# Altium schematic sheet EFR32xG22_LC_REF_DES_A02_Cover.SchDoc
size 420 x 297 mm
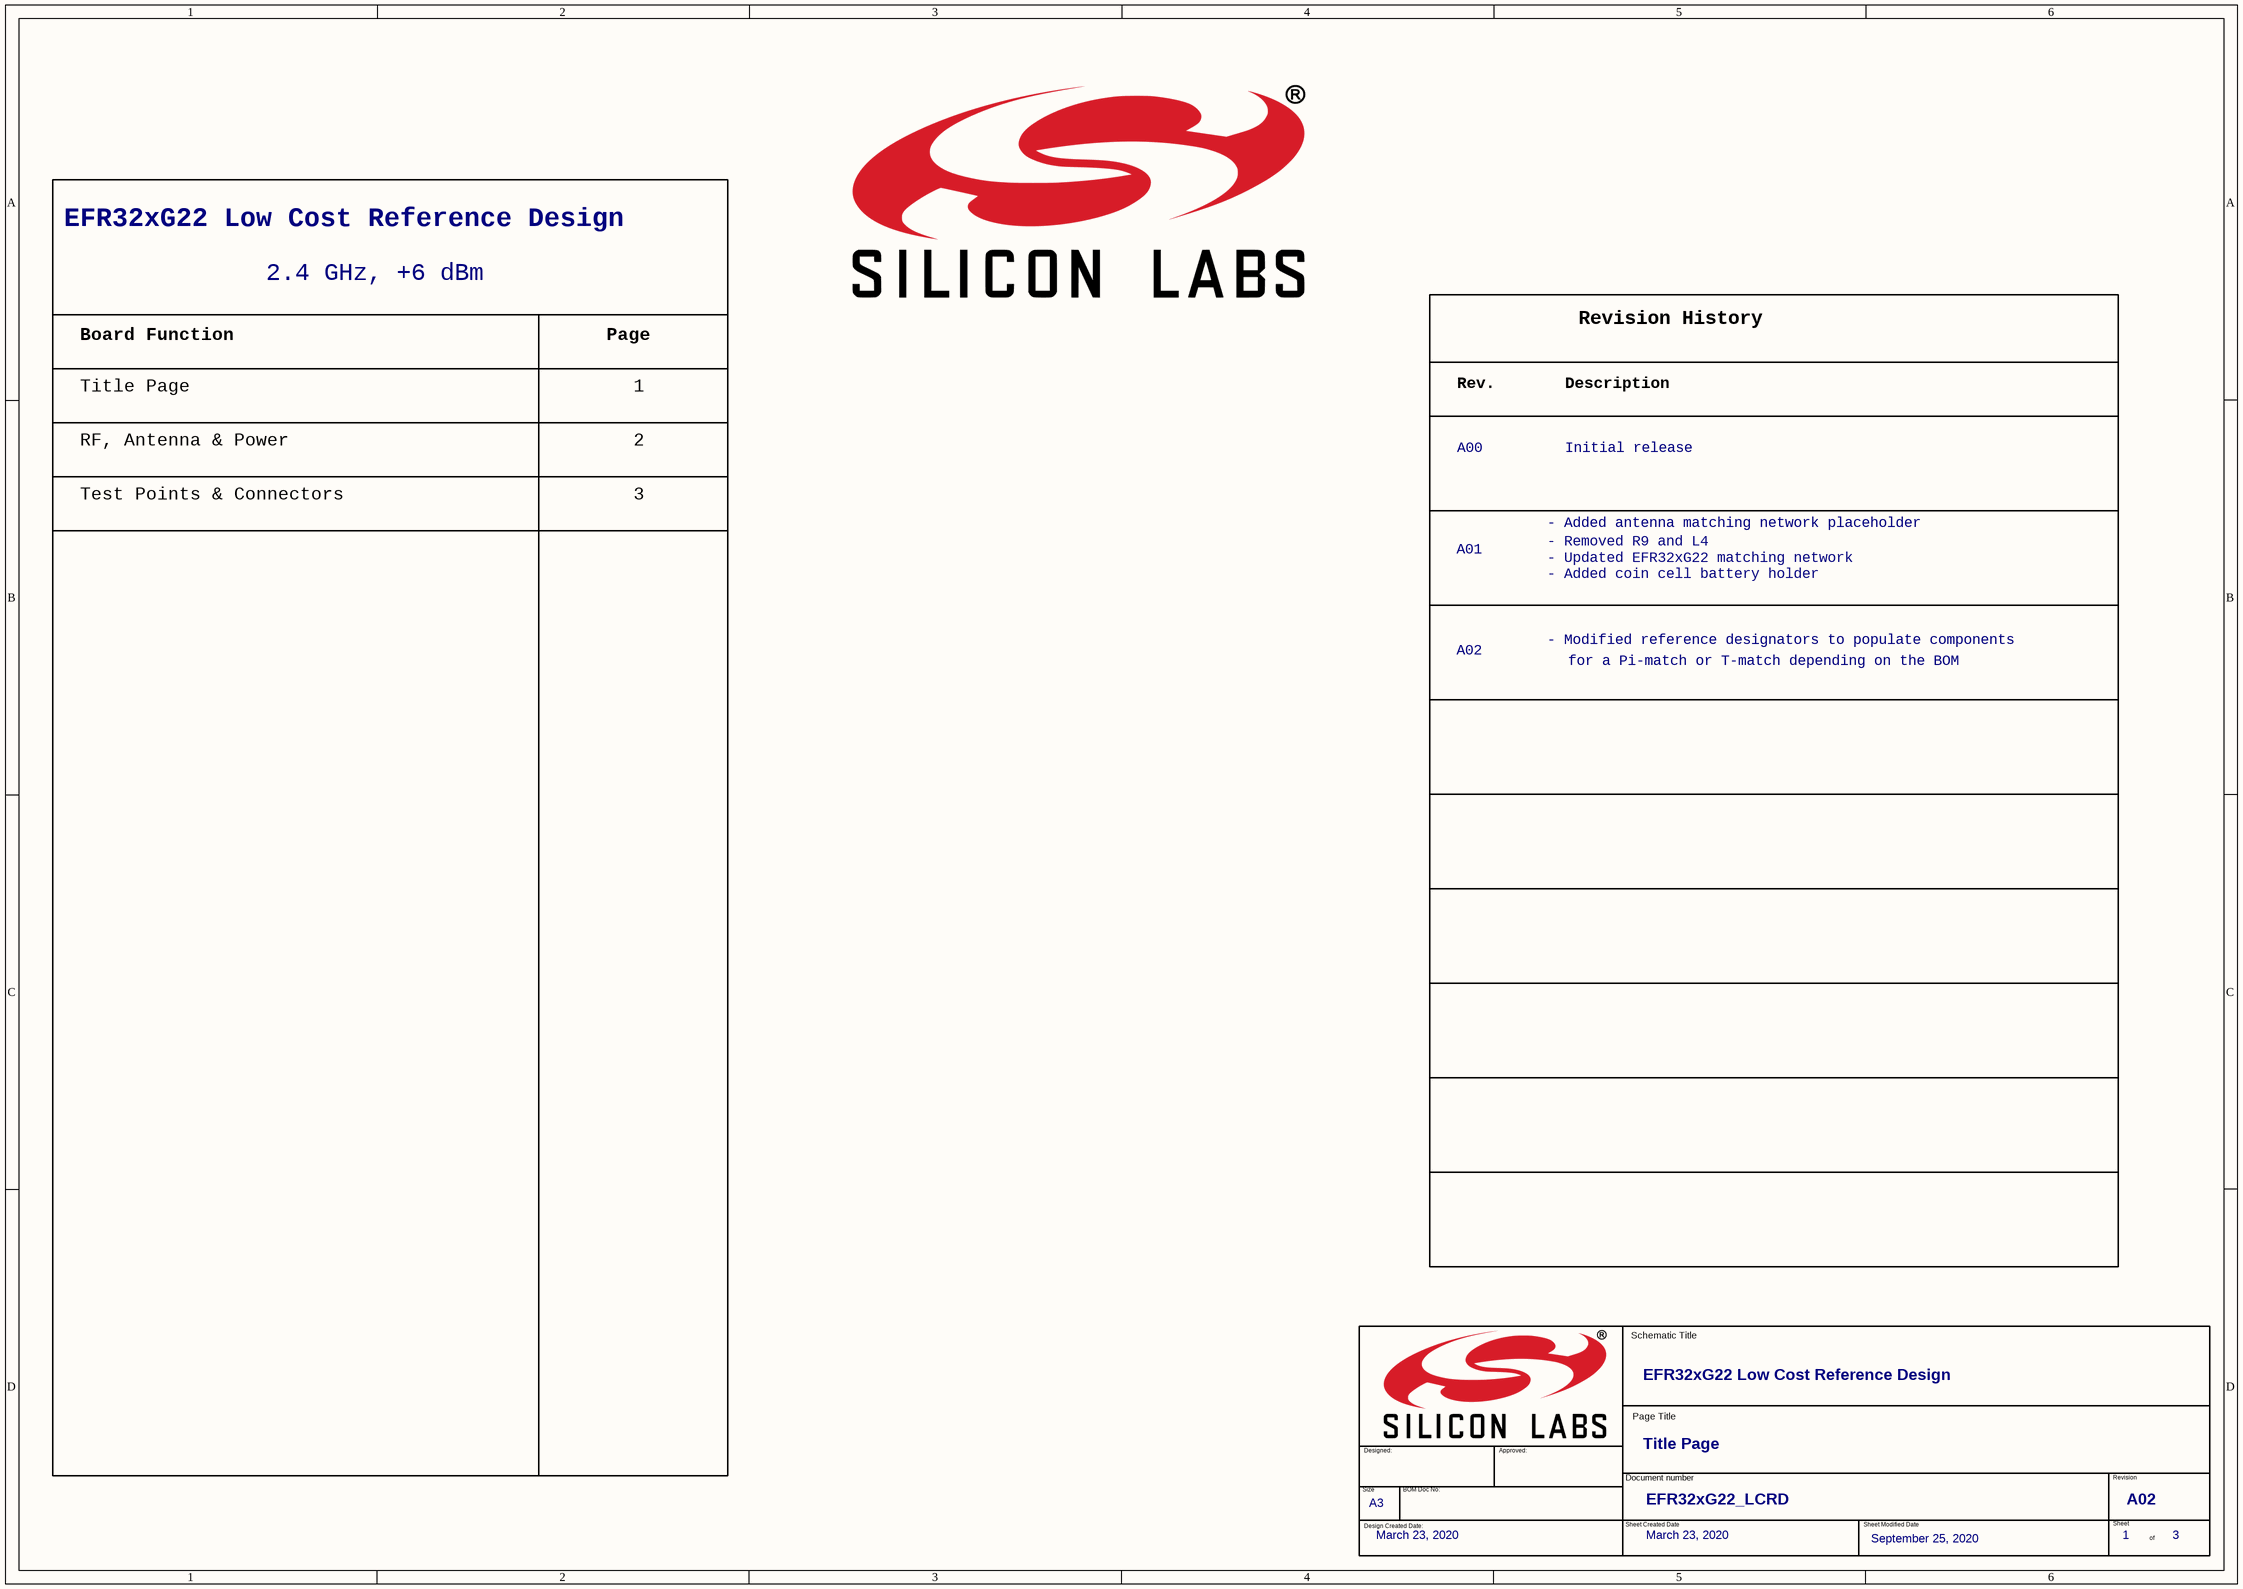
[diagram p0: EFR32xG22_LC_REF_DES_A02_Cover.SchDoc]

## Parts
(Parts that share a designator on the sheet are numbered #1, #2 ... from top to bottom, then left to right.)
*?#1  Header A: EFR32xG22 Low Cost Reference Design  (hidden comment: Toc_Header)  (graphical)
*?#2  Rev1: A00  (hidden comment: Rev_History)  (graphical)
*?#3  Page Title: Title Page  Page Size: A3  Title: EFR32xG22 Low Cost Reference Design  Page Number: 1  Page Count: 3  (hidden comment: TitleBlock_EnergyMicro_A3)  (graphical)

## Notes on the sheet
- 2.4 GHz, +6 dBm
- Board Function
- Title Page
- Page
- 1
- RF, Antenna & Power
- 2
- Initial release
- Test Points & Connectors
- 3
- - Added antenna matching network placeholder
- A01
- - Removed R9 and L4
  - Updated EFR32xG22 matching network
  - Added coin cell battery holder
- A02
- - Modified reference designators to populate components
- for a Pi-match or T-match depending on the BOM
- March 23, 2020
- EFR32xG22_LCRD
- September 25, 2020
- (in symbol Rev_History) Revision History; Rev.; Description
- (in symbol TitleBlock_EnergyMicro_A3) Schematic Title; Page Title; Designed:; Approved:; Document number; Revision; Size; BOM Doc No:; Design Created Date:; Sheet Created Date; Sheet Modified Date; Sheet; of

## Library data of the parts
*?#1 = Toc_Header: Title: EFR32xG21 2.4 GHz 20 dBm Radio Board; RevCode: A00; OrgName: Silicon Labs; Page Number: 1; Page Count: 4; Doc: BRD4180A
*?#2 = Rev_History: Initial release; Doc: BRD4180A; Title: EFR32xG21 2.4 GHz 20 dBm Radio Board; OrgAddr2: JNO; OrgAddr1: JSH; OrgName: Silicon Labs; Page Number: 1; Page Count: 5; RevCode: A00
*?#3 = TitleBlock_EnergyMicro_A3: OrgName: Silicon Labs